# EAGLE design Adafruit Ultimate GPS Flora (EAGLE 6.6.0)
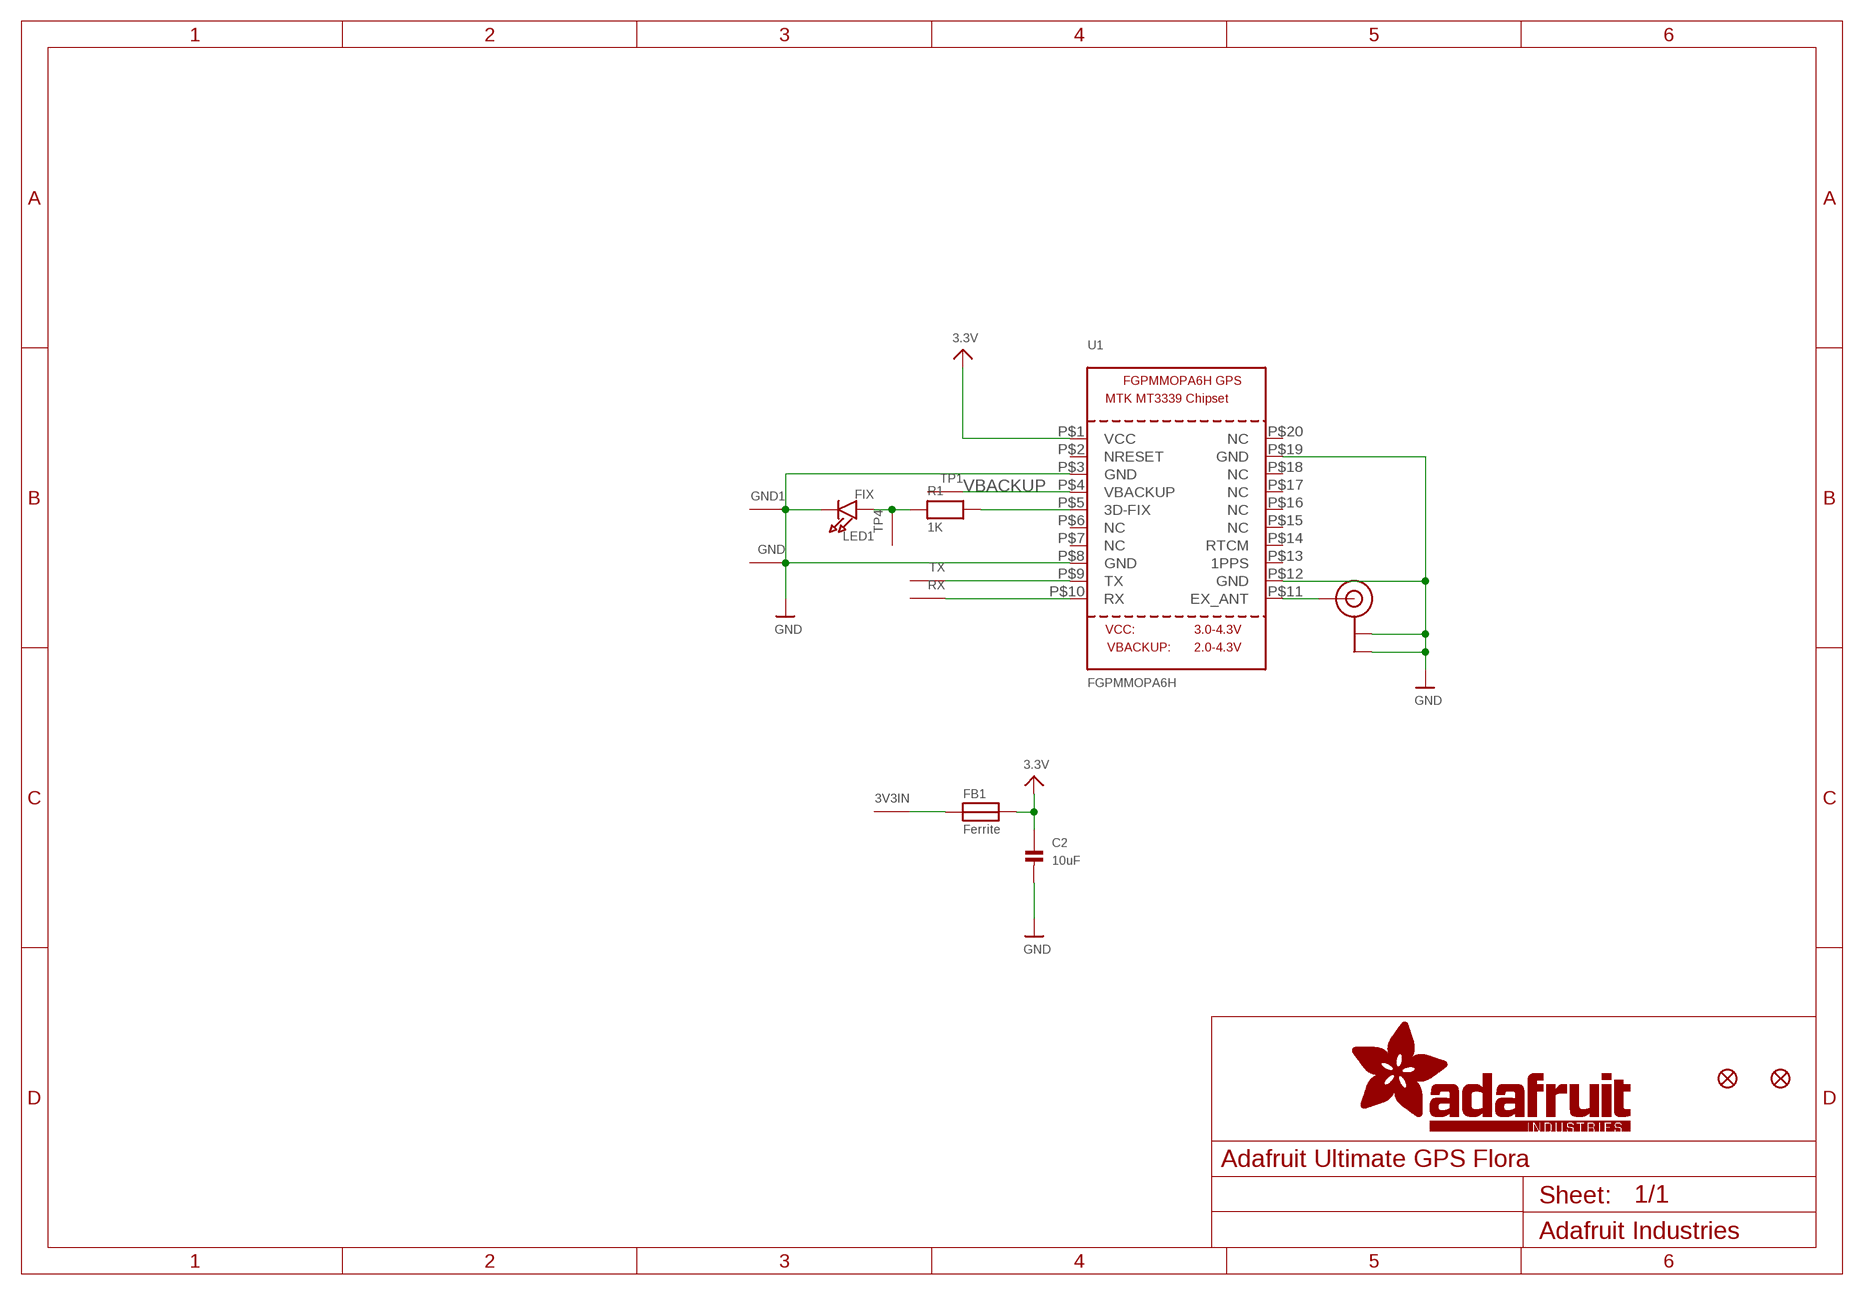
[diagram p0: schematic, sheet 1]

## Parts
3V3IN  SEWTAP-2.0IN  [SEWINGTAP_2.0]
C2  10uF  CAP_CERAMIC0805  [0805]
FB1  Ferrite  FERRITE0805  [0805]
FID1  FIDUCIAL""  [FIDUCIAL_1MM]
FID2  FIDUCIAL""  [FIDUCIAL_1MM]
GND  SEWTAP-2.0IN  [SEWINGTAP_2.0]
GND1  SEWTAP-2.0IN  [SEWINGTAP_2.0]
LED1  FIX  LED0805  [CHIPLED_0805]
R1  1K  RESISTOR0805  [0805]
RX  SEWTAP-2.0IN  [SEWINGTAP_2.0]
TP1  SEWTAP-2.0IN  [SEWINGTAP_2.0]
TP4  SEWTAP-2.0IN  [SEWINGTAP_2.0]
TX  SEWTAP-2.0IN  [SEWINGTAP_2.0]
U1  FGPMMOPA6H  GPS_FGPMMOPA6H  [FGPMMOPA6H]
U$20  U.FL  [U.FL]

## Nets
3.3V: C2.1 FB1.2 U1.P$1(VCC)
GND: C2.2 GND1.P$1(SEW) GND.P$1(SEW) LED1.C U1.P$3(GND) U1.P$8(GND) U1.P$12(GND) U1.P$19(GND) U$20.P$1(GND) U$20.P$2(GND)
N$1: LED1.A R1.1 TP4.P$1(SEW)
N$2: R1.2 U1.P$5(3D-FIX)
N$3: 3V3IN.P$1(SEW) FB1.1
N$4: U1.P$11(EX_ANT) U$20.P$3(SIGNAL)
RX: RX.P$1(SEW) U1.P$10(RX)
TX: TX.P$1(SEW) U1.P$9(TX)
VBACKUP: TP1.P$1(SEW) U1.P$4(VBACKUP)
Unconnected: U1.P$2(NRESET) U1.P$6(NC) U1.P$7(NC) U1.P$13(1PPS) U1.P$14(RTCM) U1.P$15(NC) U1.P$16(NC) U1.P$17(NC) U1.P$18(NC) U1.P$20(NC)

## Library data of the parts
3V3IN GND GND1 RX TP1 TP4 TX = adafruit:SEWTAP
C2 = microbuilder:CAP_CERAMIC: Ceramic Capacitors 0402 - 0402 Surface Mount Capacitors 16pF 50V 5% [Digikey: 445-4899-2-ND] 18pF 50V 5% [Digikey: 490-1281-2-ND] 22pF 50V 5% [Digikey: 490-1283-2-ND] 68pF 50V 5% [Digikey: 490-1289-2-ND] 0.1uF 10V 10% [Digikey: 490-1318-2-ND] 1.0uF 6.3V 10% [Digikey: 490-1320-2-ND] 0603 - 0603 Surface Mount Capacitors 16 pF 50V 5% [Digikey: 445-5051-2-ND] 22 pF 50V [Digikey: PCC220ACVTR-ND] 33 pF 50V 5% [Digikey: 490-1415-1-ND] 56pF 50V 5% [Digikey: 490-1421-1-ND] 220pF 50V 5% [Digikey: 445-1285-1-ND] 680 pF 50V 2200 pF 50V 5% C0G [Digikey: 445-1297-1-ND] 5600 pF 100V 5% X7R [Digikey: 478-3711-1-ND] 0.1 µF 25V 10% [Digikey: PCC2277TR-ND] 0.22 µF 16V 10% X7R [Digikey: 445-1318-1-ND] 1.0 µF 25V 10% [Digikey: 445-5146-2-ND] 0603 - RF Specific 3pF 250V +/-0.1pF RF [Digikey: 712-1347-1-ND] 18 pF 250V 5% [Digikey: 478-3505-1-ND or 712-1322-1-ND] 56 pF 250V 5% C0G RF [Digikey: 490-4867-1-ND] 68 pF 250V RF [Digikey: 490-4868-1-ND] 0805 - 0805 Surface Mount Capacitors 220 pF 250V 2% RF Ceramic Capacitor [Digikey: 712-1398-1-ND] 1000 pF 50V 2% NP0 Ceramic Capacitor [Digikey: 478-3760-1-ND] 0.1 µF 25V 10% Ceramic Capacitor [Digikey: PCC1828TR-ND] 1.0 µF 16V 10% Ceramic Capacitor[Digikey: 490-1691-2-ND] 10.0 µF 10V 10% Ceramic Capacitor[Digikey: 709-1228-1-ND] 10.0 uF 16V 10% Ceramic Capacitor [Digikey: 478-5165-2-ND] 47 uF 6.3V 20% Ceramic Capacitor [Digikey: 587-1779-1-ND or 399-5506-1-ND] 1206 - 1206 Surface Mount Capacitors 47uF 10V 20% Ceramic Capacitor [Digikey: 490-5528-1-ND or 399-5508-1-ND or 445-6010-1-ND] 100uF 6.3V -20%, +80% Y5V Ceramic Capacitor (Digikey: 490-4512-1-ND, Mouser: 81-GRM31CF50J107ZE1L)
FB1 = microbuilder:FERRITE: Ferrite Bead 0603 MMZ1608B121C - 120 Ohm, 600mA Ferrite Chip - Digikey: 445-2164-1-ND BK1608HW121-T - 120 Ohm, 600mA Ferrite Chip - Digikey: 587-1876-2-ND
FID1 FID2 = microbuilder:FIDUCIAL: Fiducial Alignment Points Various fiducial points for machine vision alignment.
LED1 = microbuilder:LED: LED 0603 - 0603 Surface Mount Package 2mA: Green LED - Low Power (3.9mcd, 2ma, 1.7Vf) - Digikey: 475-2709-2-ND Orange LED - Low Power (9.8mcd, 2ma, 1.8Vf) - Digikey: 475-1194-2-ND Red LED - Low Power (5mcd, 2ma, 1.8Vf) - Digikey: 475-1195-2-ND Yellow LED - Low Power (7mcd, 2ma, 1.8Vf) - Digikey: 475-1196-2-ND 5mA: Blue LED - Low Power (17mcd, 5ma, 2.9Vf) - Digikey: LNJ937W8CRACT-ND 0805 - 0805 Surface Mount Package 2mA: Red LED (8.8mcd, 2mA, 1.8Vf, Clear) - Low Power [Digikey: 475-2510-1-ND] Green LED (5mcd, 2mA, 1.8Vf, Clear) - Low Power [Digikey: 475-2730-1-ND] Yellow LED (11.3mcd, 2mA, 1.8Vf, Clear) - Low Power [Digikey: 475-2555-1-ND] 20mA: Red LED (104mcd, 20mA, Diffused) - LS R976 [Digikey: 475-1278-6-ND] Red LED (12mcd, 20mA, 2.0Vf, Clear) - APT2012EC [Digikey: 754-1128-1-ND] Green LED (15mcd, 20mA, 2.2Vf, Clear) - APT2012GC [Digikey: 754-1131-1-ND] Orange LED (160mcd, 20mA, 2.1Vf, Clear) - APT2012SECK [Digikey: 754-1130-1-ND] 1206 - 1206 Surface Mount Package Green LED (26mcd, 20mA, Diffused) - LG N971 [Digikey: 475-1407-6-ND] Red LED (15mcd, 20mA, Diffused) - LH N974 [Digikey: 475-1416-6-ND]
R1 = microbuilder:RESISTOR: Resistors 0402 - 0402 Surface Mount Package 22 Ohm 1% 1/16W [Digikey: 311-22.0LRTR-ND] 33 Ohm 5% 1/16W 1.0K 5% 1/16W 1.5K 5% 1/16W 2.0K 1% 1/16W 10.0K 1% 1/16W [Digikey: 311-10.0KLRTR-ND] 10.0K 5% 1/16W [Digikey: RMCF0402JT10K0TR-ND] 12.1K 1% 1/16W [Digikey: 311-22.0LRTR-ND] 100.0K 5% 1/16W 0603 - 0603 Surface Mount Package 0 Ohm 1/10 Watt 1% Resistor 15 Ohm 1/10 Watt 1% Resistor 33 Ohm 1/10 Watt 1% Resistor 49.9 Ohm 1/10 Watt 1% Resistor 100 Ohm 1/10 Watt 1% Resistor 150 Ohm 1/10 Watt 1% Resistor 240 Ohm 1/10 Watt 1% Resistor 390 Ohm 1/10 Watt 1% Resistor 560 Ohm 1/10 Watt 1% Resistor 680 Ohm 1/10 Watt 1% Resistor 750 Ohm 1/10 Watt 1% Resistor 1.0K Ohm 1/10 Watt 1% Resistor 1.5K Ohm 1/10 Watt 1% Resistor 2.0K Ohm 1/10 Watt 1% Resistor 2.2K Ohm 1/10 Watt 1% Resistor 3.3K Ohm 1/10 Watt 1% Resistor 4.7K Ohm 1/10 Watt 1% Resistor 10.0K Ohm 1/10 Watt 1% Resistor 12.0K Ohm 1/10 Watt 1% Resistor 12.1K Ohm 1/10 Watt 1% Resistor 20.0K Ohm 1/10 Watt 1% Resistor 33.0K Ohm 1/10 Watt 1% Resistor 100.0K Ohm 1/10 Watt 1% Resistor 0805 - 0805 Surface Mount Package 0 Ohm 1/8 Watt 1% Resistor 33 Ohm 1/8 Watt 1% Resistor 100 Ohm 1/8 Watt 1% Resistor 150 Ohm 1/8 Watt 1% Resistor 200 Ohm 1/8 Watt 1% Resistor 240 Ohm 1/8 Watt 1% Resistor 330 Ohm 1/8 Watt 1% Resistor 390 Ohm 1/8 Watt 1% Resistor 470 Ohm 1/8 Watt 1% Resistor 1.0K Ohm 1/8 Watt 1% Resistor 1.5K Ohm 1/8 Watt 1% Resistor 2.0K Ohm 1/8 Watt 1% Resistor 4.7K Ohm 1/8 Watt 1% Resistor 5.1K Ohm 1/8 Watt 1% Resistor 5.6K Ohm 1/8 Watt 1% Resistor 10.0K Ohm 1/8 Watt 1% Resistor 22.0K Ohm 1/8 Watt 1% Resistor 33.0K Ohm 1/8 Watt 1% Resistor 100K Ohm 1/8 Watt 1% Resistor 1206 - 1206 Surface Mount Package 2012 - 2010 Surface Mount Package 0.11 Ohm 1/2 Watt 1% Resistor - Digikey: RHM.11UCT-ND
U1 = microbuilder:GPS_FGPMMOPA6H: GPS Module - MTK MT3339 Chipset, -165dBm sensitivity, 22 channels, 10Hz, auto-select external antenna options
U$20 = microbuilder:U.FL: U.FL Antenna Connector

## Board
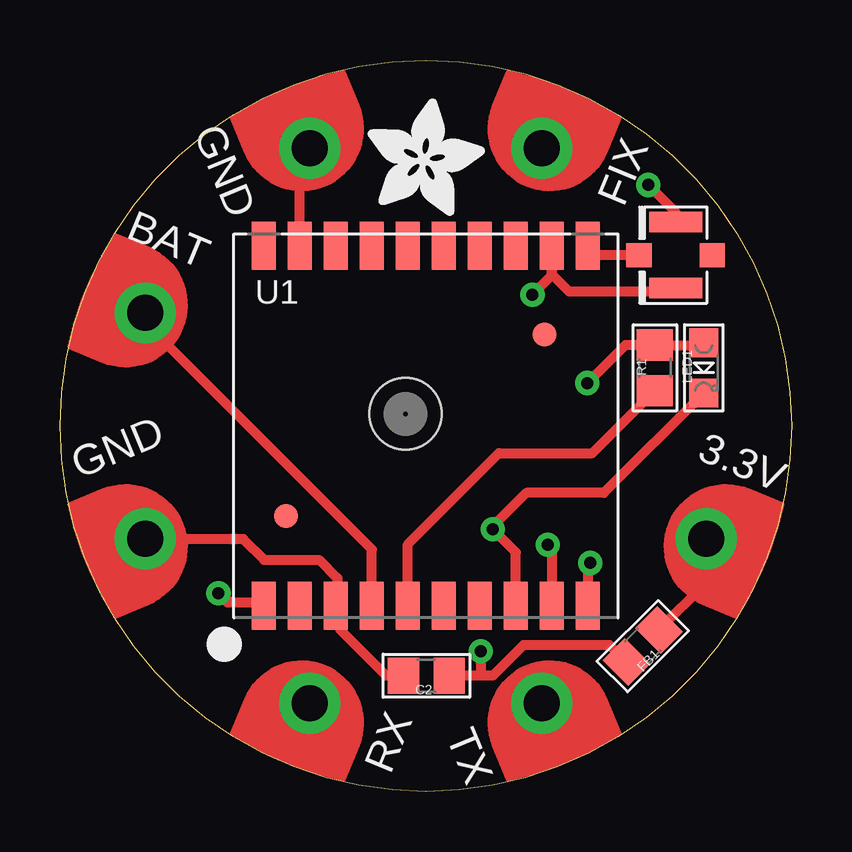
[diagram p1: board, top side]
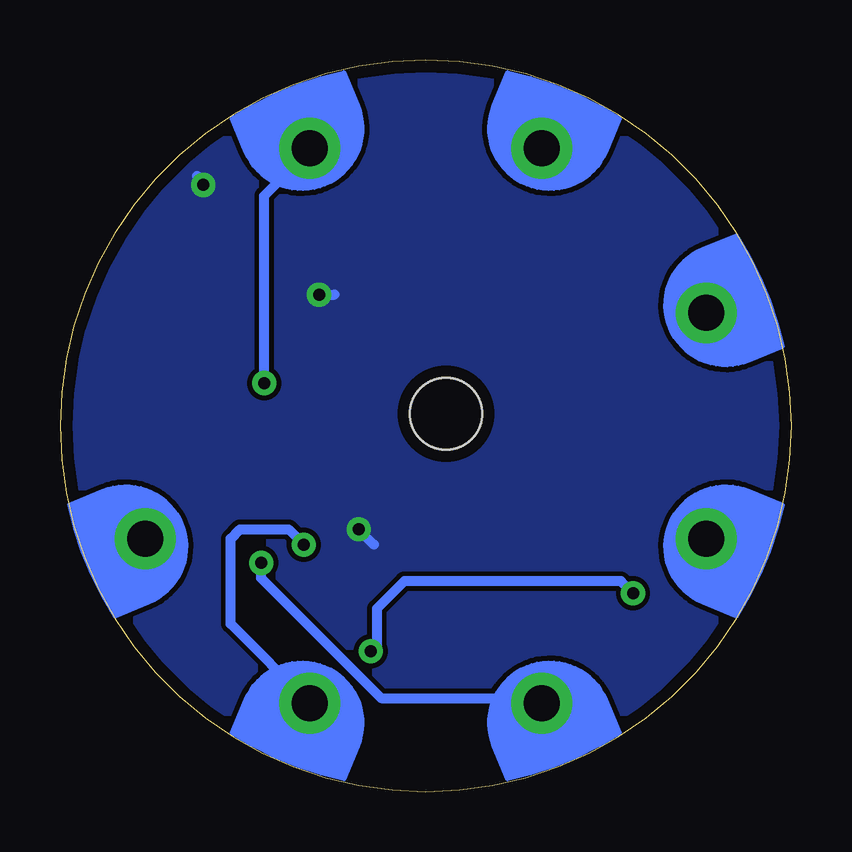
[diagram p2: board, bottom side, seen from below]

Size 30.48 x 30.48 mm. Coordinates in mm from the lower left corner, seen from the top.
Outline: 15.24,0 arc-90 0,15.24 arc-90 15.24,30.48 arc-90 30.48,15.24 arc-90 15.24,0
Copper layers (1*16): Top 0.035mm / dielectric 1.5mm / Bottom 0.035mm
Design rules "default": minimum track width 8mil, minimum drill 0.4mm, track to track 8mil, track to pad 8mil, pad to pad 8mil, via to via 8mil, smd to smd 8mil, copper to edge 20mil, drill to drill 8mil, minimum pad ring 8mil, minimum via ring 10mil, stop-mask expansion 3mil, vias tented up to drill 20mil, thermal gap 8mil

### Footprints (pad centres in the part's own frame; a part is rotated, then mirrored left to right if it is on the bottom)
SEWINGTAP_2.0 = drill 1.5 pad 2.54: P$1 0,0
0805 = smd 1.3 x 1.5: 1 -0.95,0; 2 0.95,0
FIDUCIAL_1MM = smd 1 x 1: 1 0,0
CHIPLED_0805 = smd 1.2 x 1.2: A 0,-1.05; C 0,1.05
FGPMMOPA6H = smd 2 x 1: P$1 -7.5,6.75; P$2 -7.5,5.25; P$3 -7.5,3.75; P$4 -7.5,2.25; P$5 -7.5,0.75; P$6 -7.5,-0.75; P$7 -7.5,-2.25; P$8 -7.5,-3.75; P$9 -7.5,-5.25; P$10 -7.5,-6.75; P$11 7.5,-6.75; P$12 7.5,-5.25; P$13 7.5,-3.75; P$14 7.5,-2.25; P$15 7.5,-0.75; P$16 7.5,0.75; P$17 7.5,2.25; P$18 7.5,3.75; P$19 7.5,5.25; P$20 7.5,6.75 | hole 3: 0.5,0.85
U.FL = smd 2.2 x 0.85: P$1 0,1.375; P$2 0,-1.375 | smd 1.05 x 1: P$3 1.525,0; P$4 -1.525,0

### Placement (x,y rotation side)
3V3IN  26.92,10.54 247.5 top
C2  15.26,4.83 180 top
FB1  24.28,6.06 225 top
FID1  20.19,19.05 0 top
FID2  9.42,11.47 0 top
GND  3.56,10.54 112.5 top
GND1  10.41,26.8 22.5 top
LED1  26.82,17.65 180 top
R1  24.79,17.65 270 top
RX  10.41,3.68 157.5 top
TP1  3.56,19.94 67.5 top
TP4  20.07,26.8 337.5 top
TX  20.07,3.68 202.5 top
U1  15.24,15.24 90 top
U$6  [ADAFRUIT_5MM]  12.83,24 0 top
U$7  [FLORASMALL]  24.77,22.99 270 bottom
U$20  25.65,22.35 180 top

### Tracks (layer width: path | path; a pad name or v marks a point on that pad's centre or on a via)
3.3V  (via drill 0.5)
  Top 0.406: FB1.2 22.9,6.1 19.3,6.1 18.03,4.83 17.4,4.83 | 17.4,4.83 C2.1 | U1.P$1 8.36,7.87 7.11,7.87 | 7.11,7.87 6.98,7.87 | v6.6,8.25 6.73,8.25 7.11,7.87 | v17.53,5.84 17.53,4.95 17.4,4.83
  Bottom 0.406: v6.6,8.25 7.11,8.76 16.13,8.76 17.27,7.62 17.27,6.1 v17.53,5.84
GND  (via drill 0.5)
  Top 0.406: C2.2 13.59,4.83 11.68,6.73 11.68,7.55 U1.P$3 11.56,7.81 11.56,8.89 10.79,9.65 8.51,9.65 7.64,10.52 3.56,10.52 GND.P$1 | U1.P$8 18.99,9.97 v18.03,10.92 18.03,11.05 19.43,12.45 22.66,12.45 LED1.C | U1.P$19 9.99,26.8 GND1.P$1 | U$20.P$2 25.65,24.13 v24.51,25.27 | v19.69,20.7 20.49,21.51 U1.P$12 20.49,21.55 21.21,20.83 25.65,20.83 U$20.P$1
  Bottom 0.406: v18.03,10.92 17.4,10.29 | v24.51,25.27 24.51,25.4 24.77,25.65 | v19.69,20.7 19.05,20.7
  pour Bottom: 15.24,30.48 arc90 0,15.24 0,14.48 arc90 14.61,-0.13 15.62,-0.13 arc90 30.48,14.73 30.48,16 arc90
N$1  (via drill 0.5)
  Top 0.406: LED1.A 26.72,18.6 R1.1 23.56,18.6 v21.97,17.02
  Bottom 0.406: v21.97,17.02 21.97,24.82 20.07,26.72 TP4.P$1
N$2
  Top 0.406: U1.P$5 14.49,10.3 18.29,14.1 22.18,14.1 R1.2
N$3
  Top 0.406: FB1.1 26.92,8.7 3V3IN.P$1
N$4
  Top 0.406: U$20.P$3 22.38,22.35 U1.P$11
RX  (via drill 0.5)
  Top 0.406: v22.1,9.53 21.99,9.42 U1.P$10
  Bottom 0.406: v22.1,9.53 22.1,8.89 17.1,3.89 10.41,3.89 RX.P$1
TX  (via drill 0.5)
  Top 0.406: v20.32,10.29 20.49,10.12 U1.P$9
  Bottom 0.406: v20.32,10.29 20.95,10.92 22.99,10.92 23.37,10.54 23.37,6.98 TX.P$1
VBACKUP
  Top 0.406: U1.P$4 12.99,10.09 3.56,19.53 TP1.P$1

### Text on the board
tPlace: GND | FIX | BAT | GND | 3.3V | RX | TX
bDocu: Flora GPS Module | 3.3V @ 20-25mA | Version 1.0